# EAGLE design parakeet_board_rev.07 (EAGLE 7.5.0)
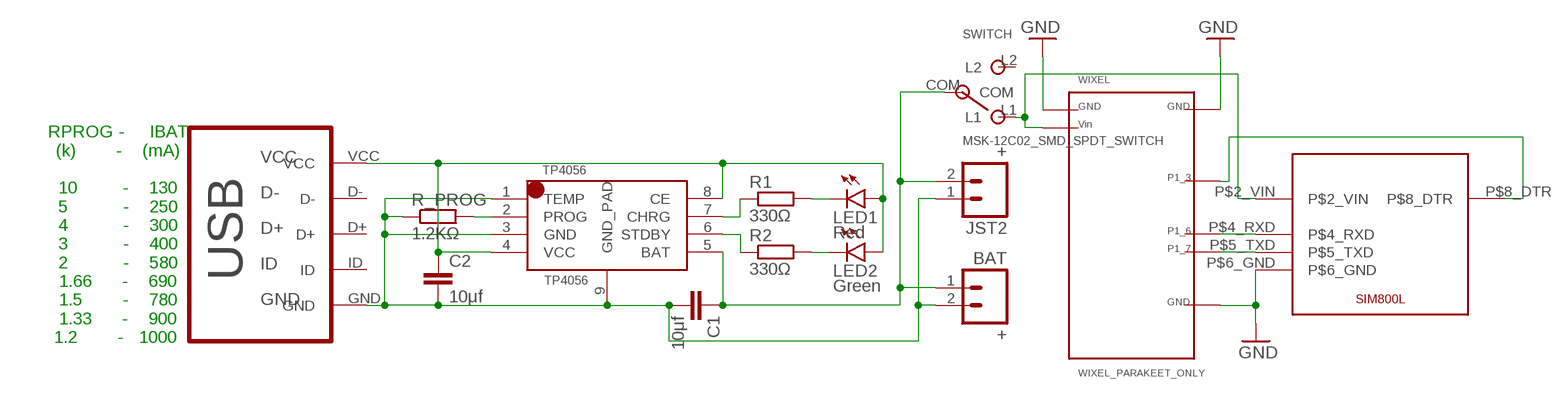
[diagram p0: schematic, sheet 1]

## Parts
+  BAT  M02PTH  [1X02]
C1  10μf  C-EUC1206  [C1206]
C2  10μf  C-EUC1206  [C1206]
JST2  +  M02-JST-2MM-SMT  [JST-2-SMD]
LED1  Red  LED1206  [LED-1206]
LED2  Green  LED1206  [LED-1206]
R1  330Ω  R-EU_R1206  [R1206]
R2  330Ω  R-EU_R1206  [R1206]
R_PROG  1.2KΩ  R-EU_R1206  [R1206]
SIM800L  SIM800L_PARAKEET_ONLY  [SIM800L_PARAKEET_ONLY]
SWITCH  MSK-12C02_SMD_SPDT_SWITCH  [MSK-12C02]
TP4056  TP4056  [SOP-8]
USB  MICRO-USB-B  [MICRO_USB_4_LEGS]
WIXEL  WIXEL_PARAKEET_ONLY  [WIXEL_PARAKEET_ONLY]

## Nets
GND: +.2 C1.2 C2.2 JST2.1 R_PROG.1 SIM800L.P$6_GND TP4056.1(TEMP) TP4056.3(GND) TP4056.9(GND_PAD) USB.GND WIXEL.P$1(P$1-GND1) WIXEL.P$12(P$12-GND2) WIXEL.P$23(P$23-GND3)
N$1: R_PROG.2 TP4056.2(PROG)
N$2: SIM800L.P$5_TXD WIXEL.P$20(P$20-P1_7)
N$3: LED1.C R1.2
N$4: LED2.C R2.2
N$5: R1.1 TP4056.7(CHRG)
N$6: R2.1 TP4056.6(STDBY)
N$7: C2.1 LED1.A LED2.A TP4056.4(VCC) TP4056.8(CE) USB.VCC
N$8: +.1 C1.1 JST2.2 SWITCH.COM TP4056.5(BAT)
N$9: SIM800L.P$4_RXD WIXEL.P$19(P$19-P1_6)
N$12: SIM800L.P$2_VIN SWITCH.L1 WIXEL.P$2(P$2-VIN)
N$13: SIM800L.P$8_DTR WIXEL.P$16(P$16-P1_3)
Unconnected: SWITCH.L2 USB.D+ USB.D- USB.ID

## Notes on the sheet
- RPROG -     IBAT
  (k)        -    (mA)
  
  10         -    130
  5           -    250
  4           -    300
  3           -    400
  2           -    580
  1.66      -    690
  1.5        -    780
  1.33      -    900
  1.2        -   1000

## Library data of the parts
+ = SparkFun-Connectors:M02: Standard 2-pin 0.1" header. Use with - straight break away headers ( PRT-00116) - right angle break away headers (PRT-00553) - swiss pins (PRT-00743) - machine pins (PRT-00117) - female headers (PRT-00115) Molex polarized connector foot print use with: PRT-08233 with associated crimp pins and housings. 2.54_SCREWTERM for use with PRT-10571. 3.5mm Screw Terminal footprints for PRT-08084 5mm Screw Terminal footprints for use with PRT-08432
C1 C2 = resistor:C-EU: CAPACITOR, European symbol
JST2 = SparkFun-Connectors:M02: Standard 2-pin 0.1" header. Use with - straight break away headers ( PRT-00116) - right angle break away headers (PRT-00553) - swiss pins (PRT-00743) - machine pins (PRT-00117) - female headers (PRT-00115) Molex polarized connector foot print use with: PRT-08233 with associated crimp pins and housings. 2.54_SCREWTERM for use with PRT-10571. 3.5mm Screw Terminal footprints for PRT-08084 5mm Screw Terminal footprints for use with PRT-08432; PROD_ID: CONN-11443
LED1 LED2 = SparkFun-LED:LED: LEDs Standard schematic elements and footprints for 5mm, 3mm, 1206, and 0603 sized LEDs. 5mm - Spark Fun Electronics SKU : COM-00529 (and others)
R1 R2 R_PROG = resistor:R-EU_: RESISTOR, European symbol
SIM800L = SIM800L Module:SIM800L_PARAKEET_ONLY
SWITCH = MSK-12C02 SMD Micro Slider Switch SPDT:MSK-12C02_SMD_SPDT_SWITCH: Footprint of the VIMEX MSK-12C02 SPDT SMD Switch Created by mzst on 17-Jan-2016
TP4056 = TP4056:TP4056
USB = micro usb B - sparkfun - china - hole 4LEGS TEST:MICRO-USB-B
WIXEL = wixel:WIXEL_PARAKEET_ONLY

## Board
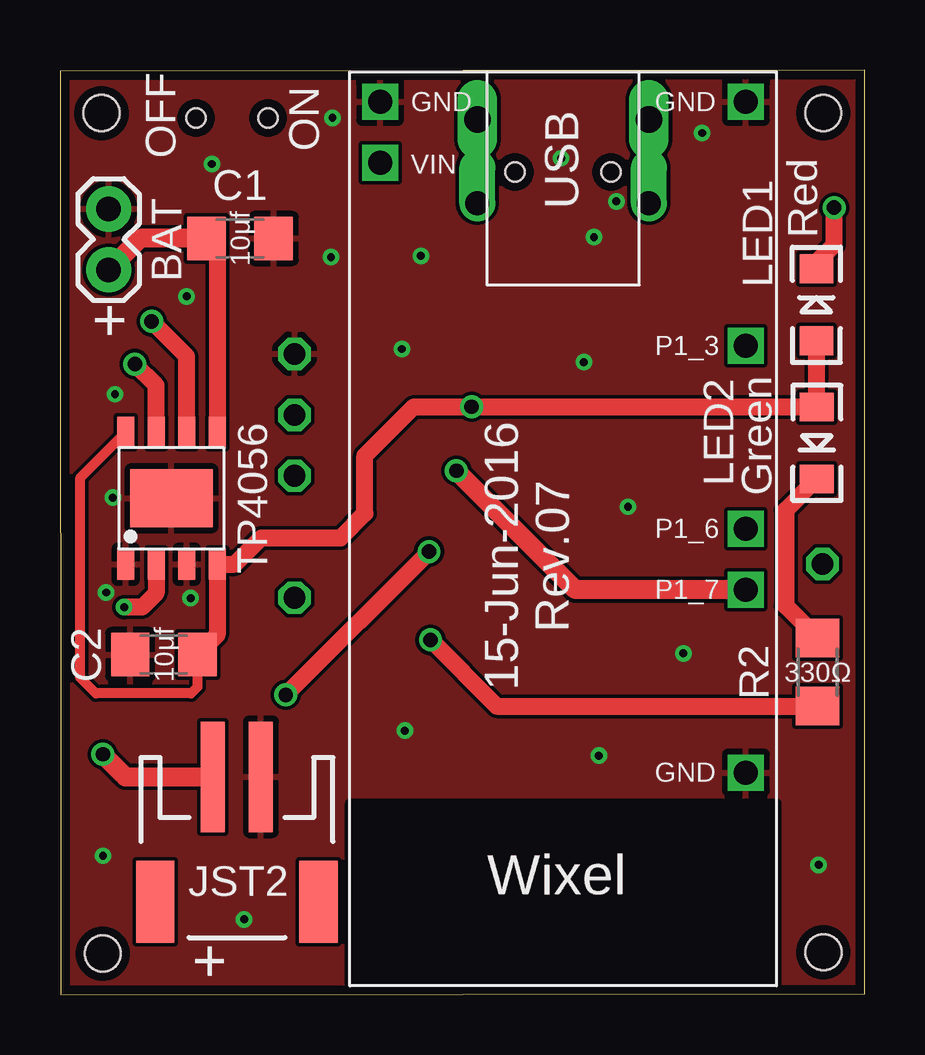
[diagram p1: board, top side]
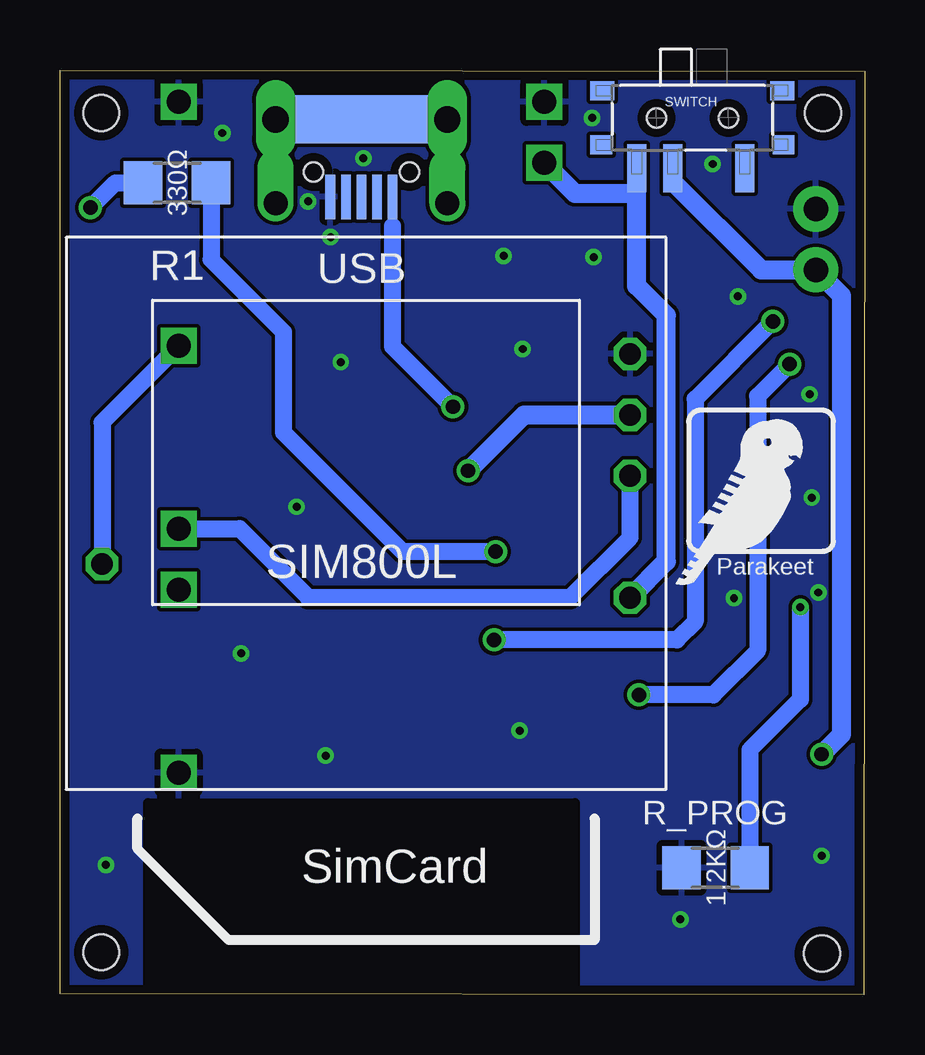
[diagram p2: board, bottom side, seen from below]

Size 33.52 x 38.52 mm. Coordinates in mm from the lower left corner, seen from the top.
Outline: 0.04,0 33.52,0.06 33.52,38.52 0,38.48 0.04,0
Copper layers (1*16): Top 0.0356mm / dielectric 1.5011mm / Bottom 0.0356mm
Design rules "LaenPCBOrderOSH *": minimum track width 6mil, minimum drill 13mil, track to track 6mil, track to pad 6mil, pad to pad 6mil, via to via 6mil, smd to smd 6mil, copper to edge 15mil, drill to drill 6mil, minimum pad ring 7mil, minimum via ring 7mil, stop-mask expansion 3mil, vias tented up to drill 25mil, thermal gap 10mil
Holes 1.5 mm at 1.78,1.72 31.81,1.78 31.8,36.75 1.72,36.74

### Footprints (pad centres in the part's own frame; a part is rotated, then mirrored left to right if it is on the bottom)
1X02 = drill 1.016 pad 1.88: 1 0,0; 2 2.54,0
C1206 = smd 1.6 x 1.8: 1 -1.4,0; 2 1.4,0
JST-2-SMD = smd 1 x 4.6: 1 -1,-3.7; 2 1,-3.7 | smd 1.6 x 3.4: NC1 -3.4,1.5; NC2 3.4,1.5
LED-1206 = smd 1.2 x 1.4: A -1.5,0; C 1.5,0
R1206 = smd 1.6 x 1.803: 1 -1.422,0; 2 1.422,0
SIM800L_PARAKEET_ONLY = drill 0.9 octagon: P$2_VIN -11,4.78; P$4_RXD -11,-0.3; P$5_TXD -11,-2.84; P$6_GND -11,-5.38; P$8_DTR 11,3.38
MSK-12C02 = smd 0.8 x 2: COM 0.823,2.1; L1 2.323,2.1; L2 -2.177,2.1 | smd 1 x 0.8: GND@1 -3.75,-1.125; GND@4 3.75,-1.125 | smd 0.9 x 0.8: GND@2 -3.8,1.125; GND@3 3.8,1.125 | hole 0.8: -1.5,0; 1.5,0
SOP-8 = smd 1.3 x 0.7: 1 -2.75,1.905; 2 -2.75,0.635; 3 -2.75,-0.635; 4 -2.75,-1.905; 5 2.75,-1.905; 6 2.75,-0.635; 7 2.75,0.635; 8 2.75,1.905 | smd 2.413 x 3.429: 9 0,0
MICRO_USB_4_LEGS = smd 1.85 x 0.4: D+ 3.125,0; D- 3.125,0.65; GND 3.125,-1.3; ID 3.125,-0.65; VCC 3.125,1.3 | drill 1.1 pad 1.5 long: P$1 -0.1,3.575; P$2 -0.1,-3.575 | drill 1 pad 1.5 offset: P$3 3.4,3.575; P$5 3.4,-3.575 | smd 2 x 6: P$4 -0.1,0 | hole 0.8: 2.1,2; 2.1,-2
WIXEL_PARAKEET_ONLY = drill 1 square: P$1 -7.62,16.51; P$2 -7.62,13.97; P$12 7.62,16.51; P$16 7.62,6.35; P$19 7.62,-1.27; P$20 7.62,-3.81 | drill 1 pad 1.422 square: P$23 7.62,-11.43

### Placement (x,y rotation side)
+  2.03,30.21 90 top
C1  7.5,31.52 0 top
C2  4.33,14.18 180 top
JST2  7.37,5.38 180 top
LED1  31.51,28.76 90 top
LED2  31.53,23 270 top
R1  28.65,33.84 180 bottom
R2  31.57,13.46 90 top
R_PROG  6.21,5.29 0 bottom
SIM800L  20.77,21.33 180 bottom
SWITCH  7.17,36.54 180 bottom
TP4056  4.64,20.69 90 top
U$1  [PARAKEET_VECTOR]  7.93,17.01 0 bottom
USB  20.96,36.38 270 bottom
WIXEL  20.96,20.69 0 top

### Tracks (layer width: path | path; a pad name or v marks a point on that pad's centre or on a via)
GND  (via drill 0.33)
  other vias: 20.88,34.86 23.19,33.06 22.25,31.57 11.29,30.74 15.04,30.79 6.33,34.62 11.35,36.54 5.28,29.1 2.29,25.03 2.2,20.72 5.44,16.53 7.67,3.15 22.45,9.97 25.98,14.23 23.67,20.34 21.83,26.36 14.25,26.91 26.76,35.91 14.37,11.01 1.92,16.77 31.61,5.42 1.79,5.8
  pour Top: -5.71,43.55 38.74,43.55 38.74,-4.71 -5.71,-4.71
  pour Bottom: -3.17,41.01 36.2,41.01 36.2,-2.17 -3.17,-2.17
N$1  (via drill 0.33)
  Top 0.7: TP4056.2 4.01,16.74 3.42,16.15 v2.67,16.15
  Bottom 0.7: v2.67,16.15 2.67,12.31 4.78,10.2 R_PROG.2
N$2  (via drill 0.6)
  Top 0.8: WIXEL.P$20 21.47,16.88 v16.52,21.84
  Bottom 0.8: v16.52,21.84 14.19,24.17 SIM800L.P$5_TXD
N$3  (via drill 0.6)
  Top 0.7: v32.26,32.8 32.26,31.26 31.51,30.52 LED1.C
  Bottom 0.7: v32.26,32.8 31.22,33.84 R1.2
N$4
  Top 0.406: R2.2 31.57,14.79 31.12,14.34
  Top 0.7: R2.2 30.23,16.21 30.23,20.2 LED2.C
N$5  (via drill 0.6)
  Top 0.7: TP4056.7 4.01,25.39 v3.12,26.28 | v15.38,18.47 v9.41,12.5
  Bottom 0.7: v15.38,18.47 19.25,18.47 24.2,23.42 24.2,27.62 27.23,30.64 R1.1 | v3.12,26.28 4.45,24.95 4.45,14.34 6.29,12.5 v9.41,12.5
N$6  (via drill 0.6)
  Top 0.7: TP4056.6 5.28,26.6 v3.82,28.06 | v15.44,14.79 18.19,12.03 R2.1
  Bottom 0.7: v3.82,28.06 7.06,24.82 7.06,15.55 7.82,14.79 v15.44,14.79
N$7  (via drill 0.6)
  Top 0.406: C2.1 5.73,12.82 5.46,12.56 1.5,12.56 0.85,13.21 0.85,21.56 TP4056.8
  Top 0.61: TP4056.8 2.72,23.42
  Top 0.7: 31.12,24.5 v17.15,24.5 14.74,24.5 12.71,22.47 12.71,20.06 11.69,19.04 8.39,19.04 7.29,17.94 TP4056.4 6.55,15 C2.1 | 31.12,24.5 31.28,24.5 | LED1.A 31.51,24.51 | 31.51,24.51 LED2.A | 31.51,24.51 31.13,24.51 31.12,24.5
  Bottom 0.406: 19.66,32.04 | 19.66,32.04 USB.VCC
  Bottom 0.7: v17.15,24.5 19.66,27.01 19.66,32.04
N$8  (via drill 0.6)
  Top 0.61: C1.1 6.55,31.49
  Top 0.7: 6.55,31.49 TP4056.5
  Top 0.8: v1.79,10.03 2.55,9.26 2.73,9.08 JST2.2 | C1.1 3.34,31.52 +.1
  Bottom 0.8: v1.79,10.03 0.96,10.85 0.96,29.14 +.1 4.31,30.21 7.99,33.89 SWITCH.COM
N$9
  Bottom 0.7: SIM800L.P$4_RXD 9.77,19.06 12.26,16.57 23.19,16.57 26.04,19.42 WIXEL.P$19
N$10
  cutout Bottom: 29.85,0.37 29.85,7.99 12.07,7.99 12.07,0.37
N$11
  cutout Top: 29.85,0.37 12.07,0.37 12.07,7.99 29.85,7.99
N$12
  Bottom 0.8: SIM800L.P$2_VIN 8.26,18.06 8.26,28.31 9.49,29.54 9.49,33.39 | 9.49,33.39 SWITCH.L1 | WIXEL.P$2 12.07,33.39 9.49,33.39
N$13
  Bottom 0.7: WIXEL.P$16 31.77,23.86 SIM800L.P$8_DTR

### Text on the board
tNames: OFF | ON | 15-Jun-2016 / Rev.07